# EAGLE schematic rpi (EAGLE 6.4)
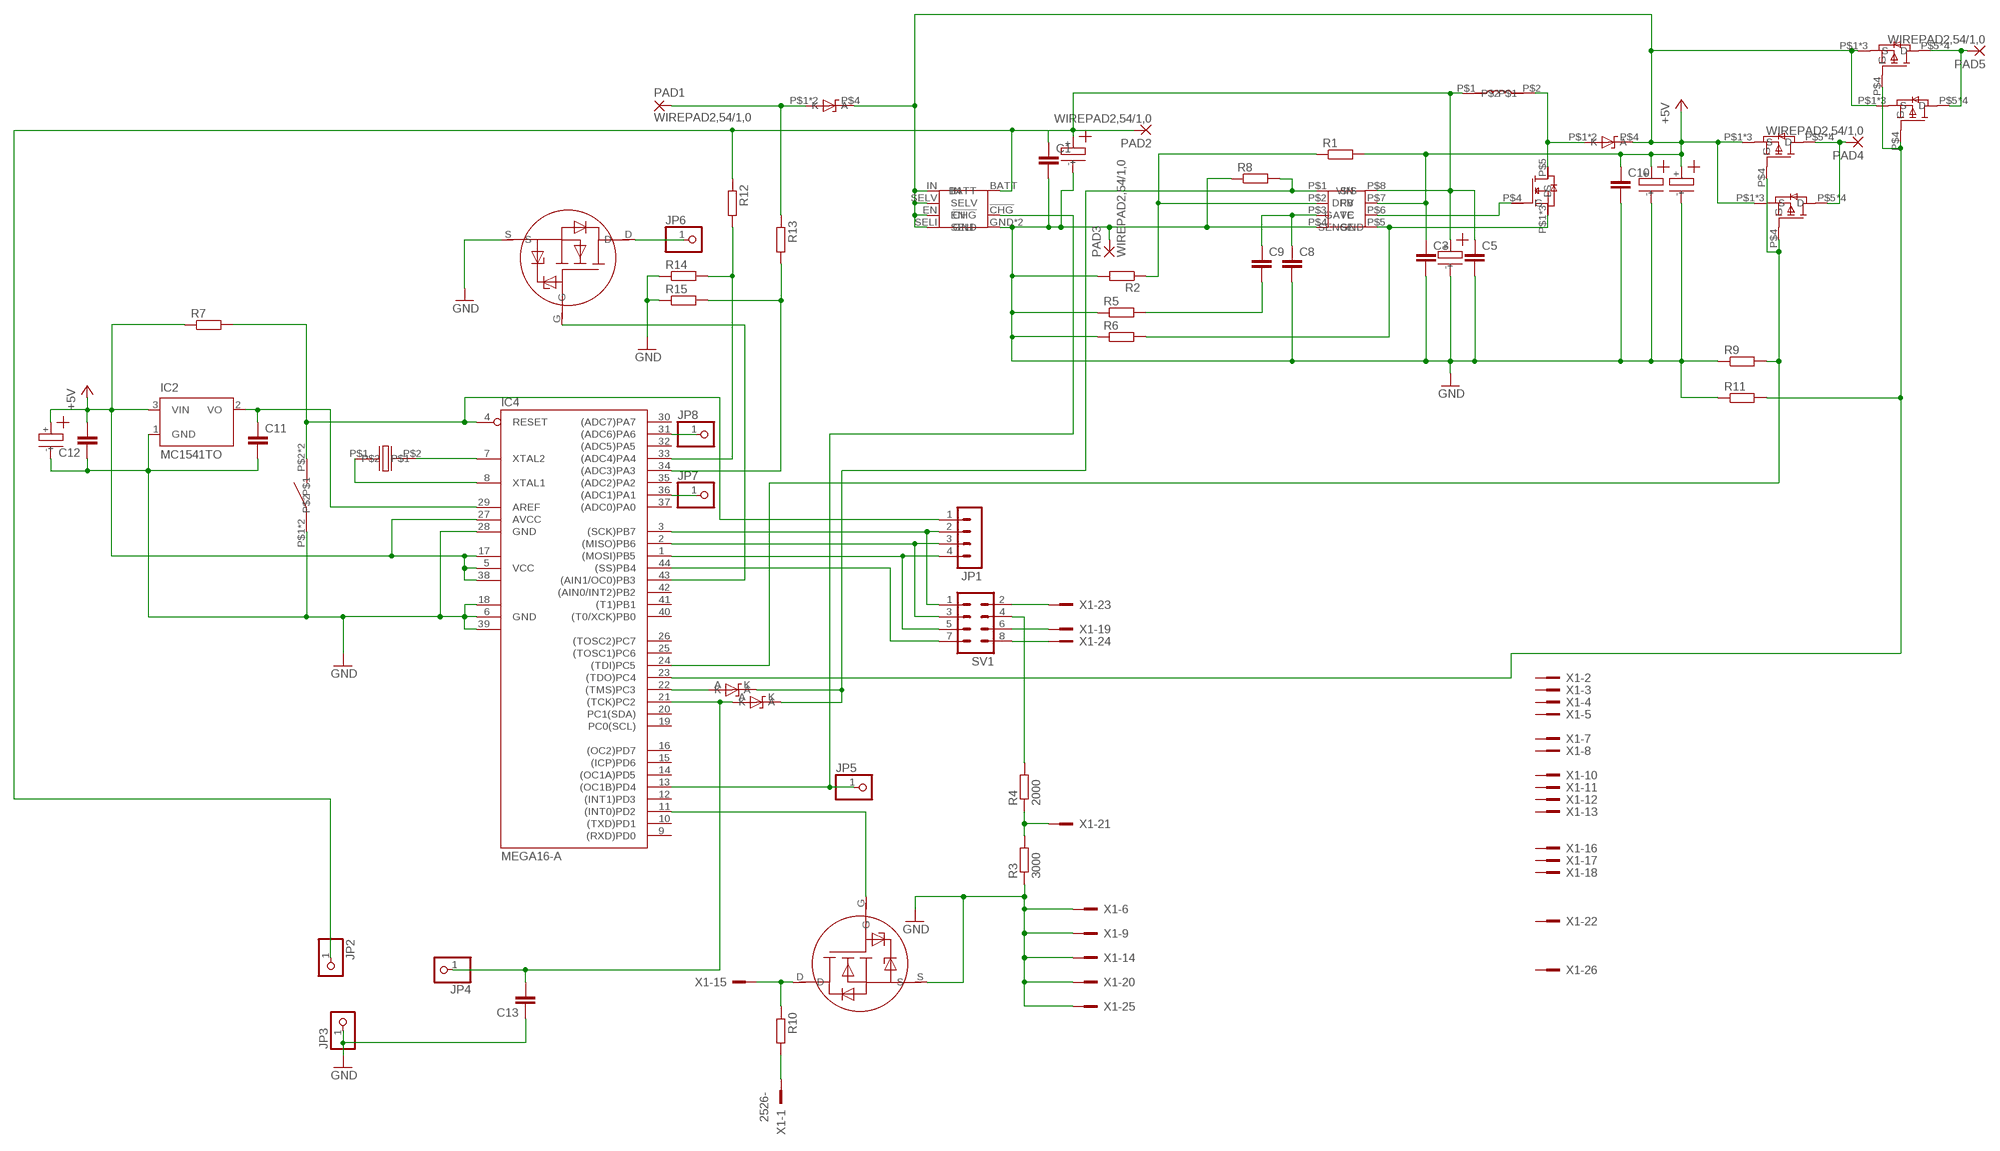
[diagram p0: schematic, sheet 1]

## Parts
C1  C-EUC1206  [C1206]
C2  UWX0J101MCL1GB  [UWX0J101MCL1GB]
C3  C-EUC1206  [C1206]
C4  UWX0J101MCL1GB  [UWX0J101MCL1GB]
C5  C-EUC1206  [C1206]
C6  UWX0J101MCL1GB  [UWX0J101MCL1GB]
C7  UWX0J101MCL1GB  [UWX0J101MCL1GB]
C8  C-EUC1206  [C1206]
C9  C-EUC1206  [C1206]
C10  C-EUC1206  [C1206]
C11  C-EUC1206  [C1206]
C12  C-EUC1206  [C1206]
C13  C-EUC1206  [C1206]
IC2  MC1541TO  [TO92]
IC4  MEGA16-A  [TQFP44]
JP1  MA04-1  [MA04-1]
JP2  PINHD-1X1  [1X01]
JP3  PINHD-1X1  [1X01]
JP4  PINHD-1X1  [1X01]
JP5  PINHD-1X1  [1X01]
JP6  PINHD-1X1  [1X01]
JP7  PINHD-1X1  [1X01]
JP8  PINHD-1X1  [1X01]
PAD1  WIREPAD2,54/1,0  [2,54/1,0]
PAD2  WIREPAD2,54/1,0  [2,54/1,0]
PAD3  WIREPAD2,54/1,0  [2,54/1,0]
PAD4  WIREPAD2,54/1,0  [2,54/1,0]
PAD5  WIREPAD2,54/1,0  [2,54/1,0]
R1  R-EU_R1206  [R1206]
R2  R-EU_R1206  [R1206]
R3  3000  R-EU_R1206  [R1206]
R4  2000  R-EU_R1206  [R1206]
R5  R-EU_R1206  [R1206]
R6  R-EU_R1206  [R1206]
R7  R-EU_R1206  [R1206]
R8  R-EU_R1206  [R1206]
R9  R-EU_R1206  [R1206]
R10  R-EU_R1206  [R1206]
R11  R-EU_R1206  [R1206]
R12  R-EU_R1206  [R1206]
R13  R-EU_R1206  [R1206]
R14  R-EU_R1206  [R1206]
R15  R-EU_R1206  [R1206]
SV1  MA04-2  [MA04-2]
U$1  LT1619S  [SO8]
U$2  NX7002AK  [SOT23]
U$3  STL100NH3LL  [POWERFLAT6X5]
U$4  MBRD835L  [DPAK]
U$5  MCBF7330-5R6MU  [MCBF7330-5R6MU]
U$6  UWX0J101MCL1GB  [UWX0J101MCL1GB]
U$7  IRF9328PBF  [SO8]
U$8  MAX1811  [SO8]
U$9  IRF9328PBF  [SO8]
U$10  XTAL14.7456MHZ  [HC49-SMD]
U$11  IRF9328PBF  [SO8]
U$12  IRF9328PBF  [SO8]
U$13  TLACITKO  [TLACITKO]
U$14  NX7002AK  [SOT23]
U$15  BAS0KFILM  [SOD-523]
U$16  MBRD835L  [DPAK]
U$17  BAS0KFILM  [SOD-523]
X1  2526-  [PAK100/2500-26]

## Nets
+5V: C3.1 C6.+ C7.+ C10.1 C12.2 IC2.3(VIN) IC4.5(VCC) IC4.17(VCC1) IC4.27(AVCC) IC4.38(VCC2) R1.2 R7.1 U$1.P$7(DRV) U$4.P$4(K) U$6.+ U$7.P$1(S) U$7.P$2(S) U$7.P$3(S) U$8.EN U$8.IN U$8.SELI U$8.SELV U$9.P$1(S) U$9.P$2(S) U$9.P$3(S) U$11.P$1(S) U$11.P$2(S) U$11.P$3(S) U$12.P$1(S) U$12.P$2(S) U$12.P$3(S) U$16.P$4(K)
AREF: C11.1 IC2.2(VO) IC4.29(AREF)
GND: C1.2 C2.- C3.2 C4.- C5.2 C6.- C7.- C8.2 C10.2 C11.2 C12.1 C13.1 IC2.1(GND) IC4.6(GND) IC4.18(GND1) IC4.28(GND) IC4.39(GND2) JP3.1 PAD3.1(P) R2.2 R3.1 R5.1 R6.1 R8.1 R9.1 R11.1 R14.1 R15.1 U$1.P$4(GND) U$2.S U$6.- U$8.GND U$8.GND2(GND) U$13.P$1 U$13.P$3 U$14.S X1.6 X1.9 X1.14 X1.20 X1.25
N$1: R3.2 R4.1 X1.21
N$2: IC4.34((ADC3)PA3) R13.2 R15.2
N$3: IC4.22((TMS)PC3) U$15.A
N$4: R4.2 SV1.4
N$5: SV1.2 X1.23
N$6: IC4.11((INT0)PD2) U$2.G
N$7: R10.2 X1.1
N$8: R10.1 U$2.D X1.15
N$9: IC4.43((AIN1/OC0)PB3) U$14.G
N$10: JP6.1 U$14.D
N$11: IC4.36((ADC1)PA1) JP7.1
N$12: R1.1 R2.1 U$1.P$2(FB)
N$13: R6.2 U$1.P$5(SENSE) U$3.P$1(S) U$3.P$2(S) U$3.P$3(S)
N$14: IC4.31((ADC6)PA6) JP8.1
N$15: IC4.24((TDI)PC5) R9.2 U$7.P$4(G) U$11.P$4(G)
N$16: IC4.33((ADC4)PA4) R12.2 R14.2
N$17: PAD1.1(P) R13.1 U$16.P$1(A) U$16.P$3(A)
N$18: U$1.P$6(GATE) U$3.P$4(G)
N$19: C13.2 IC4.21((TCK)PC2) JP4.1 U$17.A
N$20: PAD4.1(P) U$7.P$5(D) U$7.P$6(D) U$7.P$7(D) U$7.P$8(D) U$11.P$5(D) U$11.P$6(D) U$11.P$7(D) U$11.P$8(D)
N$23: U$3.P$5(D) U$4.P$1(A) U$4.P$3(A) U$5.P$2
N$24: SV1.6 X1.19
N$25: C9.2 R5.2
N$26: C8.1 C9.1 U$1.P$3(VC)
N$27: SV1.8 X1.24
N$29: PAD5.1(P) U$9.P$5(D) U$9.P$6(D) U$9.P$7(D) U$9.P$8(D) U$12.P$5(D) U$12.P$6(D) U$12.P$7(D) U$12.P$8(D)
PA3: C1.1 C2.+ C4.+ C5.1 JP2.1 PAD2.1(P) R12.1 U$1.P$8(VIN) U$5.P$1 U$8.BATT
PB4: IC4.44((SS)PB4) SV1.7
PB5: IC4.1((MOSI)PB5) JP1.4 SV1.5
PB6: IC4.2((MISO)PB6) JP1.3 SV1.3
PC3: R8.2 U$1.P$1(S/S) U$15.K U$17.K
PC4: IC4.23((TDO)PC4) R11.2 U$9.P$4(G) U$12.P$4(G)
PD5: IC4.13((OC1B)PD4) JP5.1 U$8.!CHG
RESET: IC4.4(RESET) JP1.1 R7.2 U$13.P$2 U$13.P$4
SCK: IC4.3((SCK)PB7) JP1.2 SV1.1
XTAL1: IC4.8(XTAL1) U$10.P$1
XTAL2: IC4.7(XTAL2) U$10.P$2
Unconnected: IC4.9((RXD)PD0) IC4.10((TXD)PD1) IC4.12((INT1)PD3) IC4.14((OC1A)PD5) IC4.15((ICP)PD6) IC4.16((OC2)PD7) IC4.19(PC0(SCL)) IC4.20(PC1(SDA)) IC4.25((TOSC1)PC6) IC4.26((TOSC2)PC7) IC4.30((ADC7)PA7) IC4.32((ADC5)PA5) IC4.35((ADC2)PA2) IC4.37((ADC0)PA0) IC4.40((T0/XCK)PB0) IC4.41((T1)PB1) IC4.42((AIN0/INT2)PB2) X1.2 X1.3 X1.4 X1.5 X1.7 X1.8 X1.10 X1.11 X1.12 X1.13 X1.16 X1.17 X1.18 X1.22 X1.26

## Library data of the parts
C1 C3 C5 C8-C13 = rcl:C-EU: CAPACITOR, European symbol
C2 C4 C6 C7 U$6 = tablet:UWX0J101MCL1GB
IC2 = microchip:MC15*: 2.5V and 4.096V Voltage References Source: http://www.microchip.com .. 21653b.pdf; OC_FARNELL: unknown; OC_NEWARK: unknown
IC4 = atmel:MEGA16: MICROCONTROLLER 16 Kbytes FLASH 1 kbytes SRAM 512 bytes EEPROM USART 8-channel 10 bit ADC Source: avr.lbr; MPN: ATMEGA16-16AU; OC_FARNELL: 9171134; OC_NEWARK: 96K6515
JP1 = con-lstb:MA04-1: PIN HEADER; OC_FARNELL: unknown; OC_NEWARK: unknown
JP2-JP8 = pinhead:PINHD-1X1: PIN HEADER
PAD1-PAD5 = wirepad:WIREPAD: Wire PAD connect wire on PCB
R1 R2 R5-R15 = rcl:R-EU_: RESISTOR, European symbol
R3 R4 = resistor:R-EU_: RESISTOR, European symbol
SV1 = con-lstb:MA04-2: PIN HEADER; OC_FARNELL: unknown; OC_NEWARK: unknown
U$1 = tablet:LT1619
U$2 U$14 = NX7002AK:NX7002AK
U$3 = tablet:STL100NH3LL
U$4 U$16 = tablet:MBRD835L
U$5 = tablet:MCBF7330-5R6MU
U$7 U$9 U$11 U$12 = tablet:IRF9328PBF
U$8 = max1811:MAX1811
U$10 = tablet:XTAL14.7456MHZ
U$13 = tablet:TLACITKO
U$15 U$17 = tablet:BAS0KFILM
X1 = con-3m:2526-: 3M (TM) Pak 100 4-Wall Header Source: 3M; OC_FARNELL: unknown; OC_NEWARK: unknown

## Net classes
0 default: clearance 0.355 mm